# Altium schematic sheet DWM3000_Anchor.SchDoc
size A; SheetNumber: 4; SheetTotal: 4
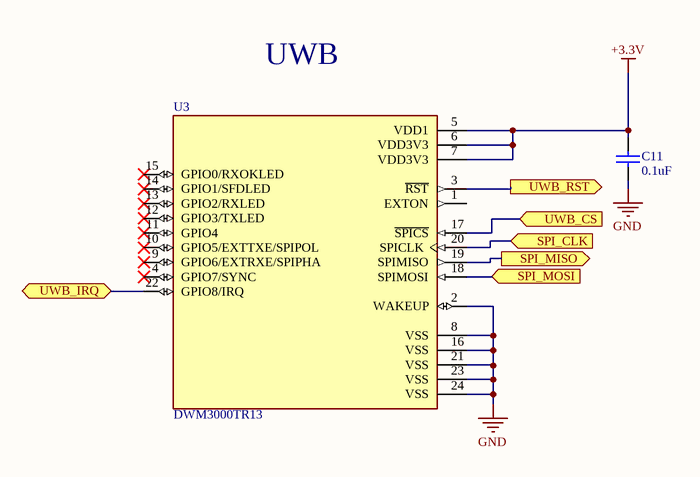
[diagram p0: DWM3000_Anchor.SchDoc]

## Parts
C11  value 0.1uF  [CAPC1005X55N]  (hidden comment: Cap)
U3  DWM3000TR13  [XCVR_DWM3000TR13]

## Ports
SPI_CLK (in), SPI_MISO (out), SPI_MOSI (in), UWB_CS (in), UWB_IRQ (bidir), UWB_RST (out)

## Nets
+3.3V: C11.2 U3.5(VDD1) U3.6(VDD3V3) U3.7(VDD3V3)
GND: C11.1 U3.2(WAKEUP) U3.8(VSS) U3.16(VSS) U3.21(VSS) U3.23(VSS) U3.24(VSS)
SPI_CLK: U3.20(SPICLK) ; port SPI_CLK
SPI_MISO: U3.19(SPIMISO) ; port SPI_MISO
SPI_MOSI: U3.18(SPIMOSI) ; port SPI_MOSI
UWB_CS: U3.17(~{SPICS}) ; port UWB_CS
UWB_IRQ: U3.22(GPIO8/IRQ) ; port UWB_IRQ
UWB_RST: U3.3(~{RST}) ; port UWB_RST

Not connected (* = marked no-connect by the designer): U3 1(EXTON) 4(GPIO7/SYNC)* 9(GPIO6/EXTRXE/SPIPHA)* 10(GPIO5/EXTTXE/SPIPOL)* 11(GPIO4)* 12(GPIO3/TXLED)* 13(GPIO2/RXLED)* 14(GPIO1/SFDLED)* 15(GPIO0/RXOKLED)*

## Notes on the sheet
- (near U3) UWB

## Library data of the parts
C11 = Cap: Capacitor; Published: 8-Jun-2000; LatestRevisionDate: 17-Jul-2002; LatestRevisionNote: Re-released for DXP Platform.; PackageReference: RAD-0.3; Publisher: Altium Limited; PackageDescription: Radial Cap, Thru-Hole; 2 Leads; 0.3 in Pin Spacing
U3 = DWM3000TR13: 802.15.4, Bluetooth, Cellular UWB, ZigbeeÂ® Transceiver Module 6.25GHz ~ 8.25GHz Integrated, Ceramic Patch Surface Mount; MF: Qorvo; SnapEDA_Link: https://www.snapeda.com/parts/DWM3000TR13/Qorvo/view-part/?ref=snap; Package: None; Value: *; MP: DWM3000TR13; Check_prices: https://www.snapeda.com/parts/DWM3000TR13/Qorvo/view-part/?ref=eda